# EAGLE design Demo_Board (EAGLE 9.5.2)
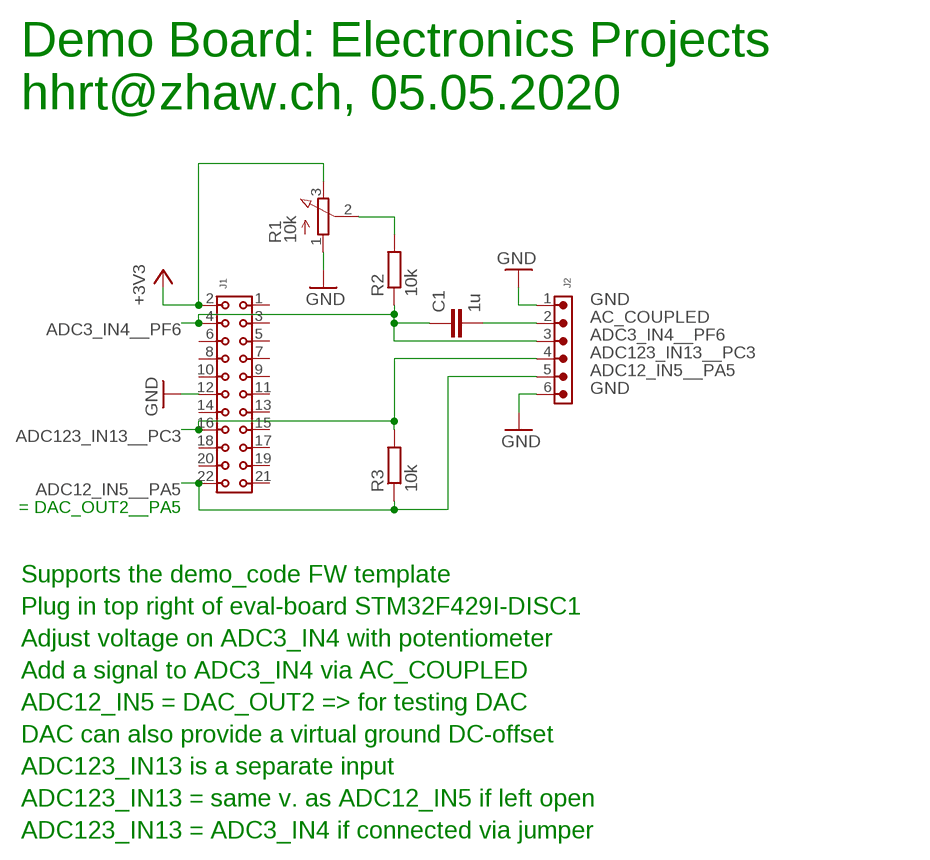
[diagram p0: schematic, sheet 1]

## Parts
C1  1u  C-EUC0805  [C0805]
J1  6130XX21821_61302221821  [61302221821]
J2  6130XX11121_61300611121  [61300611121]
R1  10k  EVUF2A  [EVUF]
R2  10k  R-EU_R0805  [R0805]
R3  10k  R-EU_R0805  [R0805]

## Nets
+3V3: J1.2 R1.3(E)
AC_COUPLED: C1.2 J2.2
ADC3_IN4__PF6: C1.1 J1.4 J2.3 R2.1
ADC12_IN5__PA5: J1.22 J2.5 R3.1
ADC123_IN13__PC3: J1.16 J2.4 R3.2
GND: J1.12 J2.1 J2.6 R1.1(A)
N$1: R1.2(S) R2.2
Unconnected: J1.1 J1.3 J1.5 J1.6 J1.7 J1.8 J1.9 J1.10 J1.11 J1.13 J1.14 J1.15 J1.17 J1.18 J1.19 J1.20 J1.21

## Notes on the sheet
- Demo Board: Electronics Projects
  hhrt@zhaw.ch, 05.05.2020
- = DAC_OUT2__PA5
- Supports the demo_code FW template
  Plug in top right of eval-board STM32F429I-DISC1
  Adjust voltage on ADC3_IN4 with potentiometer
  Add a signal to ADC3_IN4 via AC_COUPLED
  ADC12_IN5 = DAC_OUT2 => for testing DAC
  DAC can also provide a virtual ground DC-offset
  ADC123_IN13 is a separate input
  ADC123_IN13 = same v. as ADC12_IN5 if left open
  ADC123_IN13 = ADC3_IN4 if connected via jumper

## Library data of the parts
C1 = rcl:C-EU: CAPACITOR, European symbol; SPICEPREFIX: C
J1 = Wurth_Connectors_WR-PHD:6130XX21821_61302221821: WR-PHD 2.54 mm Dual Socket Header ARTICLE PROPERTIES: Pins:4;​ 6;​ 8;​ 10;​ 12;​ 14;​ 16;​ 18;​ 20;​ 22;​ 24;​ 26;​ 28;​ 30;​ 32;​ 34;​ 36;​ 40;​ 44;​ 64;​ 72 KIND PROPERTIES: Pitch：2.54 mm Quality Class:3 as per CECC 75 301-802 Rows：Dual Gender：Socket Header Type：Straight MATERIAL PROPERTIES: Insulator Material :PBT Insulator Flammability Rating:UL94 V-0 Contact Material:Copper Alloy Contact Plating:Gold Contact Type:Stamped GENERAL INFORMATION Operating Temperature:-40 up to +125 °C Compliance:Lead free / RoHS ELECTRICAL PROPERTIES: Rated Current:3 A IR 1:3 A Withstanding Voltage:500 V (AC) Contact Resistance:20 mΩ RISO:1000 MΩ CERTIFICATION UL Approval:E323964 PACKAGING PROPERTIES Packaging:Tray <https://katalog.we-online.com/media/images/v2/o57948v209%20Family_Dual_Socket_Header_WR-PHD_6130xx21821.jpg> Details see: https://katalog.we-online.com/en/em/PHD_2_54_DUAL_SOCKET_HEADER_6130XX21821 Updated by Yingchun,Shan 2019-10-21 2019 (C) Würth Elektronik; DATASHEET-URL: https://katalog.we-online.com/em/datasheet/61302221821.pdf; GENDER: Socket Header; IR: 3A; MATES: WR-PHD 2.54mm SMT Dual Pin Header/THT Angled Dual Pin Header/THT Dual Board Stacker/THT Dual Pin Header; PACKAGING: Tray; PART-NUMBER: 61302221821; PINS: 22; ROWS: Dual; TYPE: Straight
J2 = Wurth_Connectors_WR-PHD:6130XX11121_61300611121: WR-PHD 2.54 mm THT Pin Header ARTICLE PROPERTIES: Pins:1;​ 2;​ 3;​ 4;​ 5;​ 6;​ 7;​ 8;​ 9;​ 10;​ 12;​ 13;​ 14;​ 15;​ 16;​ 18;​ 20;​ 22;​ 24;​ 25;​ 32;​ 36;​ 40 KIND PROPERTIES: Pitch：2.54 mm Quality Class:3 as per CECC 75 301-802 Rows：Single Gender：Pin Header Type：Straight MATERIAL PROPERTIES: Insulator Material :PBT Insulator Flammability Rating:UL94 V-0 Contact Material:Copper Alloy Contact Plating:Gold Contact Type:Stamped GENERAL INFORMATION Operating Temperature:-40 up to +105 °C Compliance:RoHS ELECTRICAL PROPERTIES: Rated Current:3 A IR 1:3 A Withstanding Voltage:500 V (AC) Contact Resistance:20 mΩ RISO:1000 MΩ CERTIFICATION UL Approval:E323964 PACKAGING PROPERTIES Packaging:Bag <https://katalog.we-online.com/media/images/v2/o33211v209%20Family_BTB_PHD_6130xx11121.jpg> Details see: https://katalog.we-online.com/en/em/PHD_2_54_THT_PIN_HEADER_6130XX11121 Updated by Yingchun,Shan 2019-10-16 2019 (C) Würth Elektronik; DATASHEET-URL: https://katalog.we-online.com/em/datasheet/61300611121.pdf; GENDER: Pin Header; IR: 3A; MATES: WR-PHD 2.54mm Angled Socket Header /SMT Socket Header/Socket Header; PACKAGING: Bag; PART-NUMBER: 61300611121; PINS: 6; ROWS: Single; TYPE: Straight
R1 = pot:EVU: 9 mm Square Rotary Potentiometers Source: Panasonic
R2 R3 = rcl:R-EU_: RESISTOR, European symbol; SPICEPREFIX: R

## Board
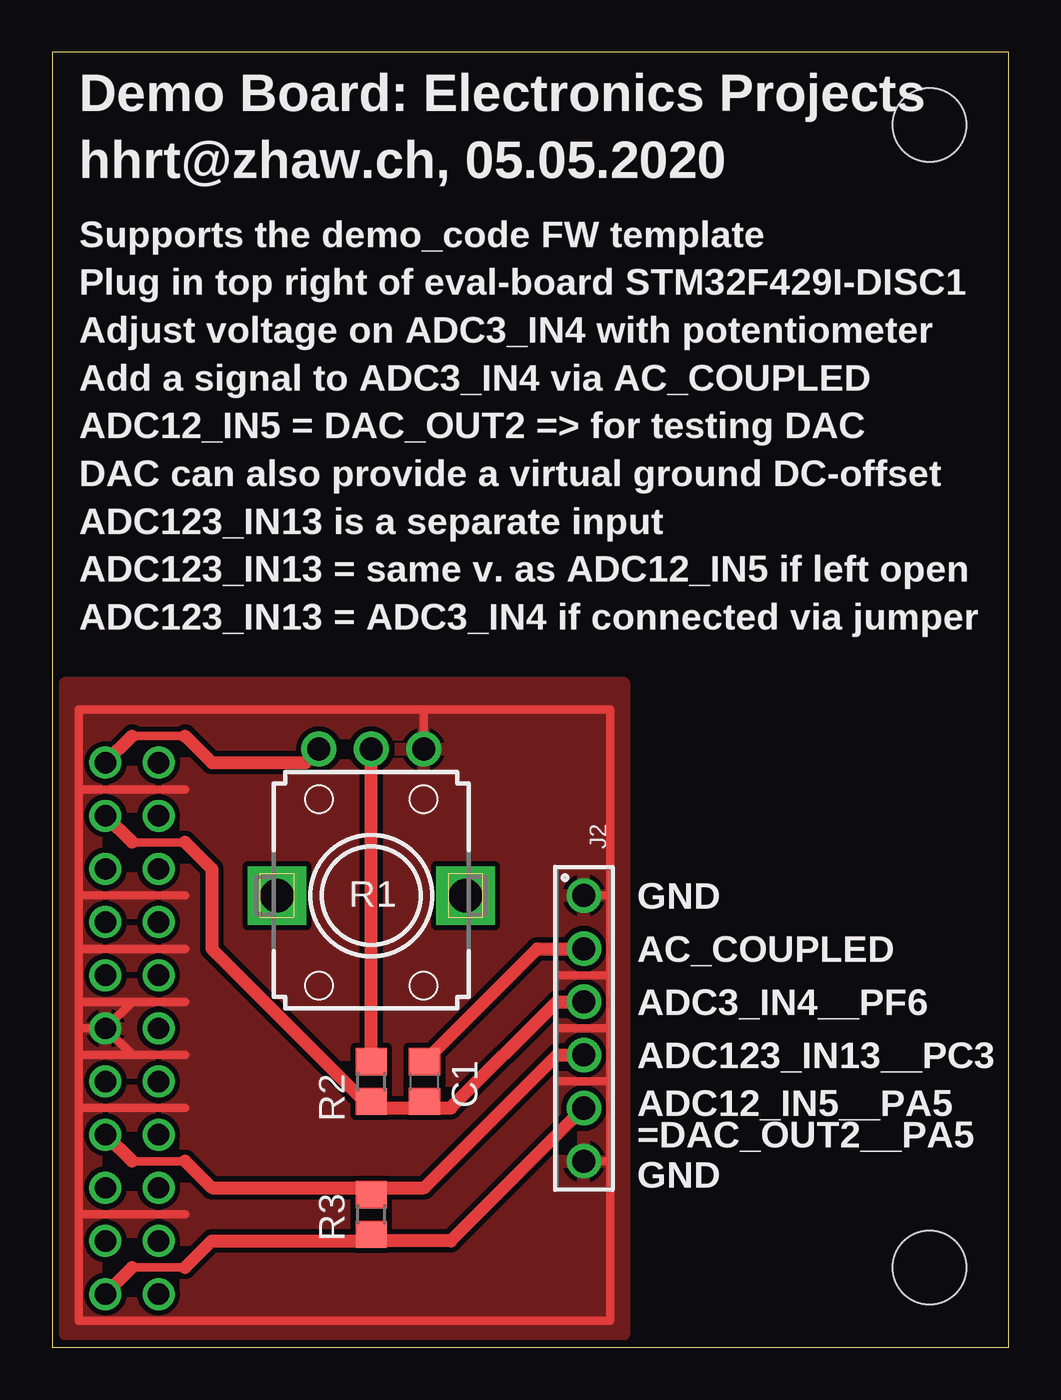
[diagram p1: board, top side]
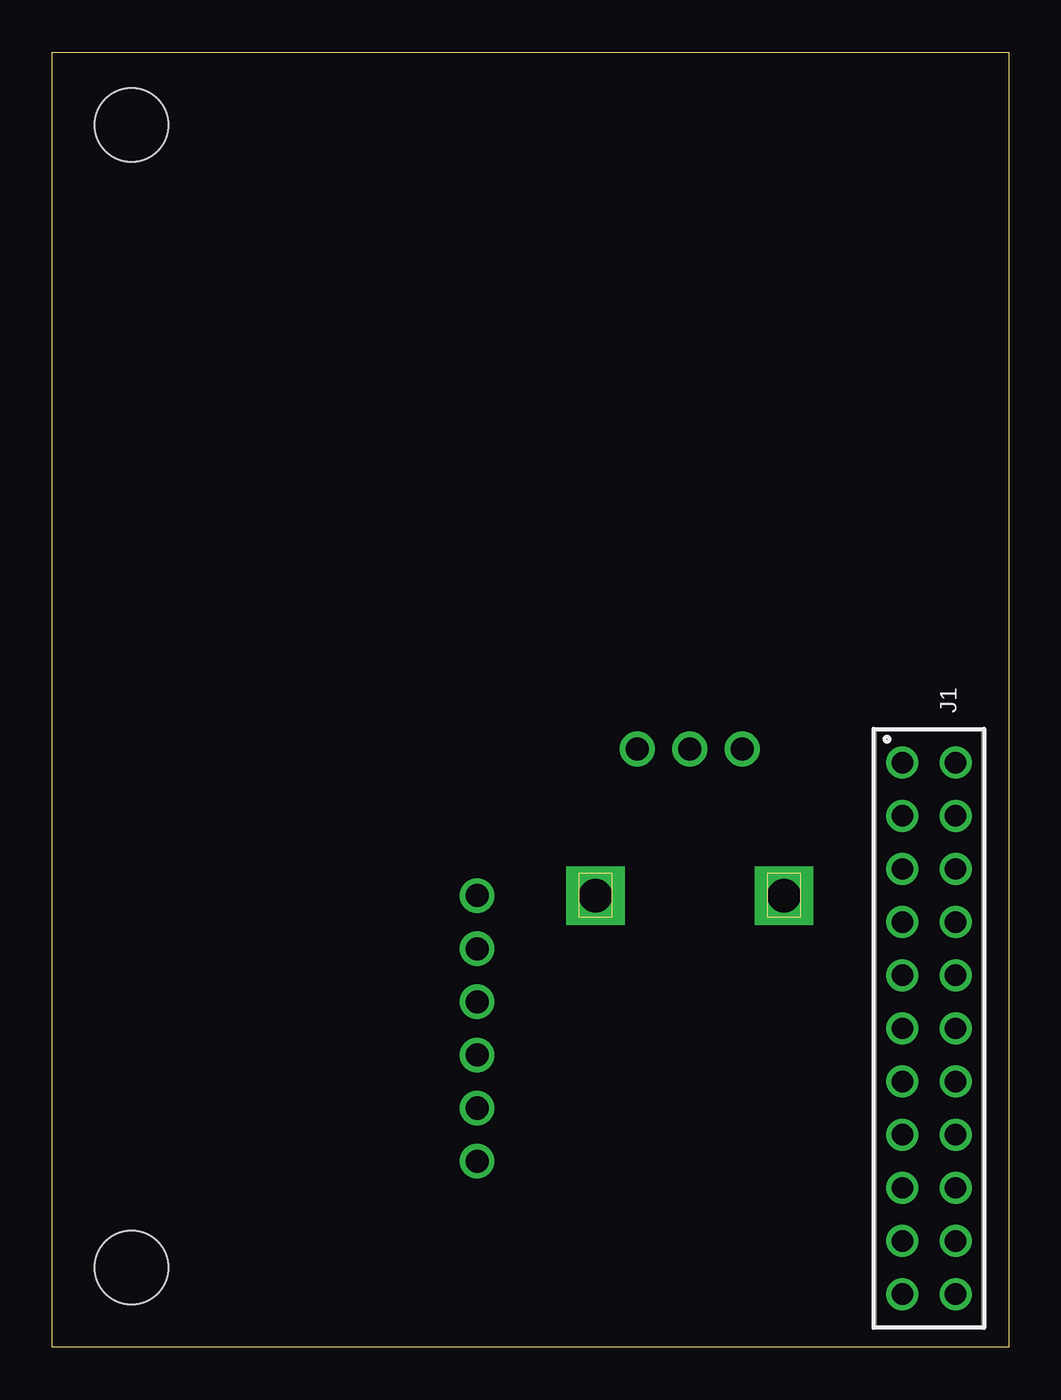
[diagram p2: board, bottom side, seen from below]

Size 45.7 x 61.9 mm. Coordinates in mm from the lower left corner, seen from the top.
Outline: 0,0 45.7,0 45.7,61.9 0,61.9 0,0
Copper layers (1*16): Top 0.018mm / dielectric 1.55mm / Bottom 0.018mm
Design rules "default": minimum track width 0.15mm, minimum drill 0.35mm, track to track 0.15mm, track to pad 0.15mm, pad to pad 0.15mm, via to via 0.15mm, smd to smd 0mil, copper to edge 0.25mm, drill to drill 0.35mm, minimum pad ring 0.175mm, minimum via ring 0.125mm, stop-mask expansion 0mil, vias tented up to drill 0.45mm, thermal gap 0.2mm
Holes 3.51 mm at 41.91,58.42 41.91,3.81

### Footprints (pad centres in the part's own frame; a part is rotated, then mirrored left to right if it is on the bottom)
C0805 = smd 1.3 x 1.5: 1 -0.95,0; 2 0.95,0
61302221821 = drill 1.02: 1 -12.7,-1.27; 2 -12.7,1.27; 3 -10.16,-1.27; 4 -10.16,1.27; 5 -7.62,-1.27; 6 -7.62,1.27; 7 -5.08,-1.27; 8 -5.08,1.27; 9 -2.54,-1.27; 10 -2.54,1.27; 11 0,-1.27; 12 0,1.27; 13 2.54,-1.27; 14 2.54,1.27; 15 5.08,-1.27; 16 5.08,1.27; 17 7.62,-1.27; 18 7.62,1.27; 19 10.16,-1.27; 20 10.16,1.27; 21 12.7,-1.27; 22 12.7,1.27
61300611121 = drill 1.1: 1 -6.35,0; 2 -3.81,0; 3 -1.27,0; 4 1.27,0; 5 3.81,0; 6 6.35,0
EVUF = drill 1.1 pad 1.676: 1 -2.5,-7; 2 0,-7; 3 2.5,-7 | drill 1.6 pad 2.8 square: M1 4.5,0; M2 -4.5,0
R0805 = smd 1.3 x 1.5: 1 -0.95,0; 2 0.95,0

### Placement (x,y rotation side)
C1  17.78,12.7 90 top
J1  3.81,15.24 270 bottom
J2  25.4,15.24 270 top
R1  15.24,21.59 180 top
R2  15.24,12.7 90 top
R3  15.24,6.35 90 top

### Tracks (layer width: path | path; a pad name or v marks a point on that pad's centre or on a via)
+3V3
  Top 0.406: 3.81,29.21 6.35,29.21
  Top 0.61: R1.3 12.09,27.94 7.62,27.94 6.35,29.21 | J1.2 3.81,29.21
AC_COUPLED
  Top 0.61: C1.2 23.18,19.05 J2.2
ADC3_IN4__PF6
  Top 0.406: 3.81,24.13 6.35,24.13
  Top 0.61: J1.4 3.81,24.13 | 6.35,24.13 7.62,22.86 7.62,19.05 15.08,11.59 R2.1 15.56,11.43 17.78,11.43 C1.1 18.1,11.43 19.05,11.43 24.13,16.51 J2.3
ADC12_IN5__PA5
  Top 0.406: 3.81,3.81 6.35,3.81
  Top 0.61: J1.22 3.81,3.81 | 6.35,3.81 7.62,5.08 15.24,5.08 | 15.24,5.08 R3.1 | J2.5 19.05,5.08 15.24,5.08
ADC123_IN13__PC3
  Top 0.406: 3.81,8.89 6.35,8.89
  Top 0.61: J1.16 3.81,8.89 | 6.35,8.89 7.62,7.62 14.92,7.62 R3.2 15.56,7.62 17.78,7.62 24.13,13.97 J2.4
GND
  Top 0.406: J1.12 1.27,15.24 | 1.27,15.24 1.27,16.51 | 1.27,16.51 1.27,19.05 | 1.27,19.05 1.27,21.59 | 1.27,21.59 1.27,26.67 | 1.27,26.67 1.27,30.48 17.78,30.48 | 1.27,15.24 1.27,13.97 | 1.27,13.97 1.27,11.43 | 1.27,11.43 1.27,6.35 | 1.27,6.35 1.27,1.27 26.67,1.27 26.67,8.89 | 1.27,26.67 6.35,26.67 | J1.12 3.81,16.51 | 6.35,16.51 3.81,16.51 | J1.12 3.81,13.97 | 6.35,13.97 3.81,13.97 | 1.27,6.35 6.35,6.35 | 1.27,21.59 6.35,21.59 | 1.27,19.05 6.35,19.05 | 1.27,11.43 6.35,11.43 | 3.81,16.51 1.27,16.51 | 3.81,13.97 1.27,13.97 | J2.1 26.67,21.59 | 26.67,21.59 26.67,17.78 | 26.67,17.78 26.67,15.24 | 26.67,15.24 26.67,12.7 | 26.67,12.7 26.67,8.89 | J2.6 26.67,8.89 | 26.67,17.78 24.13,17.78 | 26.67,15.24 24.13,15.24 | 26.67,12.7 24.13,12.7 | 17.78,30.48 26.67,30.48 26.67,21.59 | R1.1 17.74,30.44 17.78,30.48
  pour Top (isolate 0.254): 0.64,31.75 27.3,31.75 27.3,0.64 0.64,0.64
N$1
  Top 0.61: R2.2 R1.2

### Text on the board
tNames: Demo Board: Electronics Projects / hhrt@zhaw.ch, 05.05.2020 | Supports the demo_code FW template / Plug in top right of eval-board STM32F429I-DISC1 / Adjust voltage on ADC3_IN4 with potentiometer / Add a signal to ADC3_IN4 via AC_COUPLED / ADC12_IN5 = DAC_OUT2 => for testing DAC / DAC can also provide a virtual ground DC-offset / ADC123_IN13 is a separate input / ADC123_IN13 = same v. as ADC12_IN5 if left open / ADC123_IN13 = ADC3_IN4 if connected via jumper | GND | AC_COUPLED | ADC3_IN4__PF6 | ADC123_IN13__PC3 | ADC12_IN5__PA5 / =DAC_OUT2__PA5 | GND